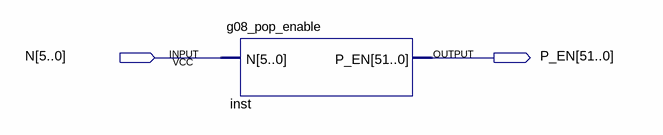
[diagram p0: schematic sheet]
// Quartus schematic g08_pop_enable.bdf as structural Verilog: 1 symbols, 2 pins
module g08_pop_enable (
  input  [5:0] N,
  output [51:0] P_EN
);

  g08_pop_enable inst (.N(N), .P_EN(P_EN));
endmodule
